# EAGLE design czbd-v0.12 (EAGLE 6.6.0)
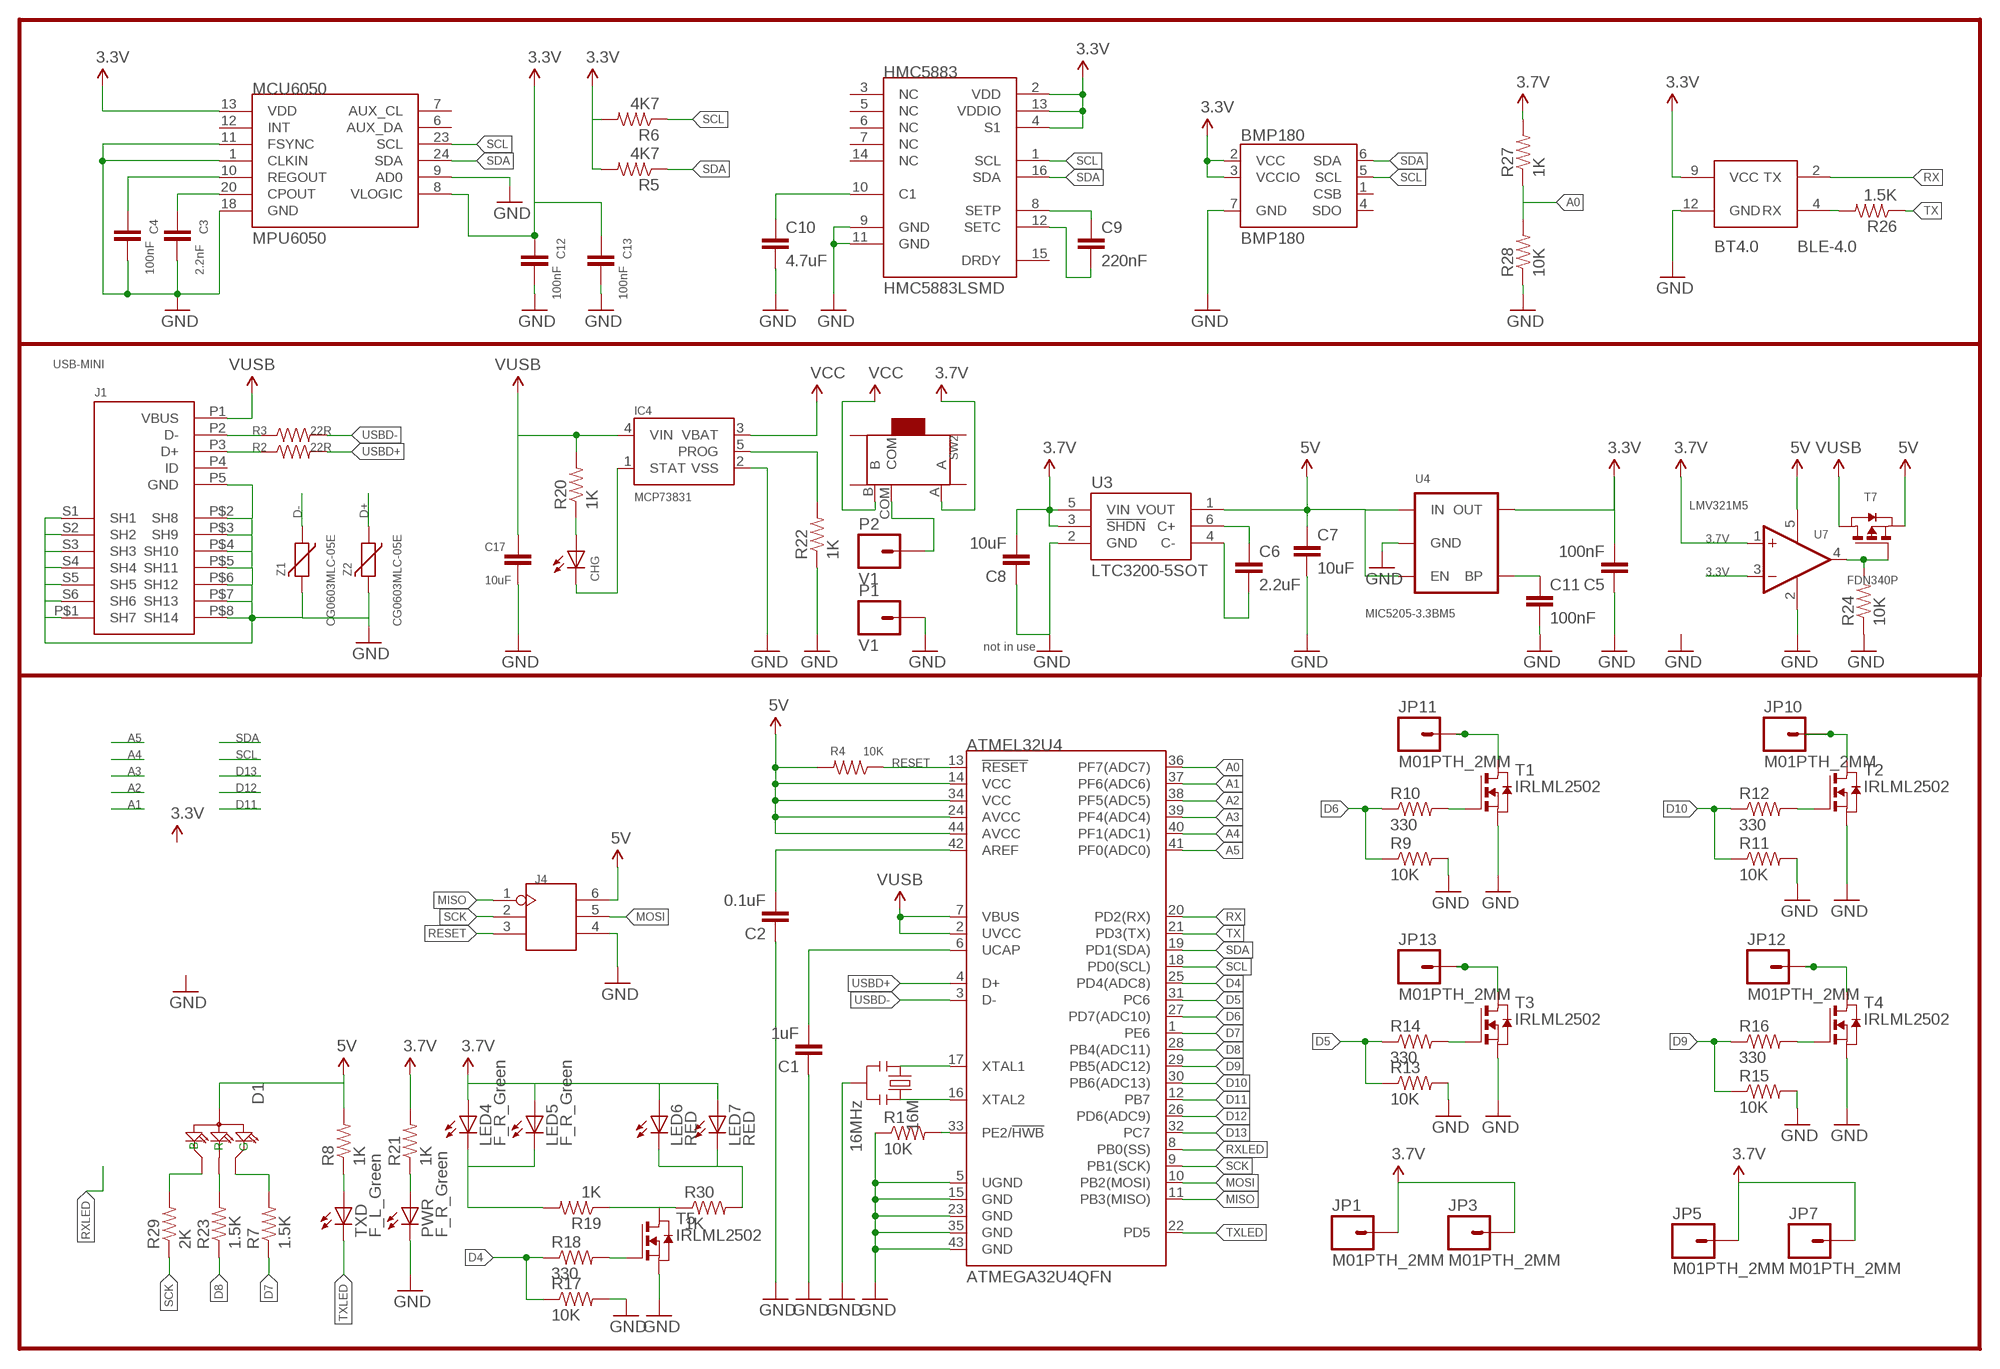
[diagram p0: schematic, sheet 1]

## Parts
16M  16MHz  RESONATOR16MHZ  [RESONATOR-SMD]
ATMEL32U4  ATMEGA32U4QFN  [SPARKFUN-DIGITALIC_QFN-44]
BMP180  BMP180  [BMP180]
BT4.0  BLE-4.0  HEXAIRBOT-HEXNANO_BLUETOOTH_HM11  [HEXAIRBOT-HEXNANO_BLUETOOTH_HM11]
C1  1uF  CAP0402-CAP  [0402-CAP]
C2  0.1uF  CAP0402-CAP  [0402-CAP]
C3  2.2nF  CAP0402-CAP  [0402-CAP]
C4  100nF  CAP0402-CAP  [0402-CAP]
C5  100nF  CAP0402-CAP  [0402-CAP]
C6  2.2uF  CAP0402-CAP  [0402-CAP]
C7  10uF  CAP0402-CAP  [0402-CAP]
C8  10uF  CAP0805  [0805]
C9  220nF  CAP0402-CAP  [0402-CAP]
C10  4.7uF  CAP0402-CAP  [0402-CAP]
C11  100nF  CAP0402-CAP  [0402-CAP]
C12  100nF  CAP0402-CAP  [0402-CAP]
C13  100nF  CAP0402-CAP  [0402-CAP]
C17  10uF  CAP0805  [0805]
CHG  Yellow  LEDCHIPLED_0603  [CHIPLED_0603]
D1  LED-ARGB-4P-1206  [LED-4P-1206-3.0X1.5]
HMC5883  HMC5883LSMD  [16LPCC]
IC4  MCP73831  [SOT23-5]
J1  USB-MINI  [USB_MICRO]
J4  CONNECTOR_HEADER-2X3P-2.0  [CONNECTOR_2X3P-2.0]
JP1  M01PTH_2MM  [1X01_2MM]
JP3  M01PTH_2MM  [1X01_2MM]
JP5  M01PTH_2MM  [1X01_2MM]
JP7  M01PTH_2MM  [1X01_2MM]
JP10  M01PTH_2MM  [1X01_2MM]
JP11  M01PTH_2MM  [1X01_2MM]
JP12  M01PTH_2MM  [1X01_2MM]
JP13  M01PTH_2MM  [1X01_2MM]
LED4  F_R_Green  LEDCHIPLED_0603  [CHIPLED_0603]
LED5  F_R_Green  LEDCHIPLED_0603  [CHIPLED_0603]
LED6  RED  LEDCHIPLED_0603  [CHIPLED_0603]
LED7  RED  LEDCHIPLED_0603  [CHIPLED_0603]
MCU6050  MPU6050  TESTING_MPU-6050-1  [TESTING_QFN-24-4MM2]
P1  V1  M01PTH  [1X01]
P2  V1  M01PTH  [1X01]
PWR  F_R_Green  LEDCHIPLED_0603  [CHIPLED_0603]
R1  10K  RESISTOR0402-RES  [0402-RES]
R2  22R  RESISTOR0402-RES  [0402-RES]
R3  22R  RESISTOR0402-RES  [0402-RES]
R4  10K  RESISTOR0402-RES  [0402-RES]
R5  4K7  RESISTOR0402-RES  [0402-RES]
R6  4K7  RESISTOR0402-RES  [0402-RES]
R7  1.5K  RESISTOR0402-RES  [0402-RES]
R8  1K  RESISTOR0402-RES  [0402-RES]
R9  10K  RESISTOR0402-RES  [0402-RES]
R10  330  RESISTOR0402-RES  [0402-RES]
R11  10K  RESISTOR0402-RES  [0402-RES]
R12  330  RESISTOR0402-RES  [0402-RES]
R13  10K  RESISTOR0402-RES  [0402-RES]
R14  330  RESISTOR0402-RES  [0402-RES]
R15  10K  RESISTOR0402-RES  [0402-RES]
R16  330  RESISTOR0402-RES  [0402-RES]
R17  10K  RESISTOR0402-RES  [0402-RES]
R18  330  RESISTOR0402-RES  [0402-RES]
R19  1K  RESISTOR0402-RES  [0402-RES]
R20  1K  RESISTOR0402-RES  [0402-RES]
R21  1K  RESISTOR0402-RES  [0402-RES]
R22  1K  RESISTOR0402-RES  [0402-RES]
R23  1.5K  RESISTOR0402-RES  [0402-RES]
R24  10K  RESISTOR0402-RES  [0402-RES]
R26  1.5K  RESISTOR0402-RES  [0402-RES]
R27  1K  RESISTOR0402-RES  [0402-RES]
R28  10K  RESISTOR0402-RES  [0402-RES]
R29  2K  RESISTOR0402-RES  [0402-RES]
R30  1K  RESISTOR0402-RES  [0402-RES]
SW2  SWITCH-3P-SMD-6.6X2.8  [3P-SMD-2CH-6.6X2.8-REINFORCE]
T1  IRLML2502  NMOSSOT23  [SOT-23]
T2  IRLML2502  NMOSSOT23  [SOT-23]
T3  IRLML2502  NMOSSOT23  [SOT-23]
T4  IRLML2502  NMOSSOT23  [SOT-23]
T5  IRLML2502  NMOSSOT23  [SOT-23]
T7  FDN340P  [SOT23]
TXD  F_L_Green  LEDCHIPLED_0603  [CHIPLED_0603]
U3  LTC3200-5SOT  [SOT23-6]
U4  MIC5205-3.3BM5  MIC52053.3V  [SOT23-5]
U7  LMV321M5  [SOT23-5]
Z1  CG0603MLC-05E  VARISTORCN0603  [CT/CN0603]
Z2  CG0603MLC-05E  VARISTORCN0603  [CT/CN0603]

## Nets
3.3V: BMP180.2(VCC) BMP180.3(VCCIO) BT4.0.9(VCC) C5.2 C12.1 C13.1 HMC5883.2(VDD) HMC5883.4(S1) HMC5883.13(VDDIO) MCU6050.8(VLOGIC) MCU6050.13(VDD) R5.2 R6.2 U4.5(OUT) U7.3(-IN)
3.7V: C8.2 JP1.1 JP3.1 JP5.1 JP7.1 LED4.A LED5.A LED6.A LED7.A R21.2 R27.2 SW2.A U3.3(!SHDN) U3.5(VIN) U7.1(+IN)
5V: ATMEL32U4.14(VCC) ATMEL32U4.24(AVCC) ATMEL32U4.34(VCC) ATMEL32U4.44(AVCC) C7.1 D1.2(+) J4.6 R4.2 R8.2 T7.2(S) U3.1(VOUT) U4.1(IN) U4.3(EN) U7.5(V+)
A0: ATMEL32U4.36(PF7(ADC7)) R27.1 R28.2
A1: ATMEL32U4.37(PF6(ADC6))
A2: ATMEL32U4.38(PF5(ADC5))
A3: ATMEL32U4.39(PF4(ADC4))
A4: ATMEL32U4.40(PF1(ADC1))
A5: ATMEL32U4.41(PF0(ADC0))
D4: ATMEL32U4.25(PD4(ADC8)) R17.1 R18.1
D5: ATMEL32U4.31(PC6) R13.1 R14.1
D6: ATMEL32U4.27(PD7(ADC10)) R9.1 R10.1
D7: ATMEL32U4.1(PE6) R7.1
D8: ATMEL32U4.28(PB4(ADC11)) R23.1
D9: ATMEL32U4.29(PB5(ADC12)) R15.1 R16.1
D10: ATMEL32U4.30(PB6(ADC13)) R11.1 R12.1
D11: ATMEL32U4.12(PB7)
D12: ATMEL32U4.26(PD6(ADC9))
D13: ATMEL32U4.32(PC7)
D+: J1.P3(D+) R2.1 Z2.1
D-: J1.P2(D-) R3.1 Z1.1
GND [gnd]: 16M.2 ATMEL32U4.5(UGND) ATMEL32U4.15(GND) ATMEL32U4.23(GND) ATMEL32U4.35(GND) ATMEL32U4.43(GND) BMP180.7(GND) BT4.0.12(GND) C1.1 C2.1 C3.2 C4.2 C5.1 C7.2 C8.1 C10.2 C11.2 C12.2 C13.2 C17.1 HMC5883.9(GND) HMC5883.11(GND) IC4.2(VSS) J1.P5(GND) J1.P$1(SH7) J1.P$2(SH8) J1.P$3(SH9) J1.P$4(SH10) J1.P$5(SH11) J1.P$6(SH12) J1.P$7(SH13) J1.P$8(SH14) J1.S1(SH1) J1.S2(SH2) J1.S3(SH3) J1.S4(SH4) J1.S5(SH5) J1.S6(SH6) J4.4 MCU6050.1(CLKIN) MCU6050.9(AD0) MCU6050.11(FSYNC) MCU6050.18(GND) P1.1 PWR.C R1.1 R9.2 R11.2 R13.2 R15.2 R17.2 R22.1 R24.1 R28.1 T1.2(S) T2.2(S) T3.2(S) T4.2(S) T5.2(S) U3.2(GND) U4.2(GND) U7.2(V-) Z1.2 Z2.2
MISO: ATMEL32U4.11(PB3(MISO)) J4.1
MOSI: ATMEL32U4.10(PB2(MOSI)) J4.5
N$1: 16M.1 ATMEL32U4.17(XTAL1)
N$2: 16M.3 ATMEL32U4.16(XTAL2)
N$3: CHG.C IC4.1(STAT)
N$4: CHG.A R20.1
N$5: ATMEL32U4.6(UCAP) C1.2
N$6: ATMEL32U4.42(AREF) C2.2
N$7: R8.1 TXD.A
N$8: C4.1 MCU6050.10(REGOUT)
N$9: C3.1 MCU6050.20(CPOUT)
N$10: D1.1(B) R29.2
N$11: ATMEL32U4.33(PE2/!HWB) R1.2
N$12: R18.2 T5.3(G)
N$13: PWR.A R21.1
N$14: R12.2 T2.3(G)
N$15: R10.2 T1.3(G)
N$16: JP11.1 T1.1(D)
N$17: JP10.1 T2.1(D)
N$18: R14.2 T3.3(G)
N$19: JP13.1 T3.1(D)
N$20: R16.2 T4.3(G)
N$21: JP12.1 T4.1(D)
N$22: R19.1 R30.1 T5.1(D)
N$23: C9.1 HMC5883.8(SETP)
N$24: LED4.C LED5.C R19.2
N$25: C6.1 U3.6(C+)
N$26: IC4.5(PROG) R22.2
N$27: C6.2 U3.4(C-)
N$28: C9.2 HMC5883.12(SETC)
N$29: C10.1 HMC5883.10(C1)
N$30: P2.1 SW2.COM
N$31: C11.1 U4.4(BP)
N$32: D1.4(R) R23.2
N$33: D1.3(G) R7.2
N$34: R24.2 T7.3(G) U7.4(OUT)
N$35: BT4.0.4(RX) R26.2
N$36: LED6.C LED7.C R30.2
RESET: ATMEL32U4.13(!RESET) J4.3 R4.1
RX: ATMEL32U4.20(PD2(RX)) BT4.0.2(TX)
RXLED: ATMEL32U4.8(PB0(SS))
SCK: ATMEL32U4.9(PB1(SCK)) J4.2 R29.1
SCL: ATMEL32U4.18(PD0(SCL)) BMP180.5(SCL) HMC5883.1(SCL) MCU6050.23(SCL) R6.1
SDA: ATMEL32U4.19(PD1(SDA)) BMP180.6(SDA) HMC5883.16(SDA) MCU6050.24(SDA) R5.1
TX: ATMEL32U4.21(PD3(TX)) R26.1
TXLED: ATMEL32U4.22(PD5) TXD.C
USBD+: ATMEL32U4.4(D+) R2.2
USBD-: ATMEL32U4.3(D-) R3.2
VCC: IC4.3(VBAT) SW2.B
VUSB: ATMEL32U4.2(UVCC) ATMEL32U4.7(VBUS) C17.2 IC4.4(VIN) J1.P1(VBUS) R20.2 T7.1(D)
Unconnected: BMP180.1(CSB) BMP180.4(SDO) HMC5883.3(NC) HMC5883.5(NC) HMC5883.6(NC) HMC5883.7(NC) HMC5883.14(NC) HMC5883.15(DRDY) J1.P4(ID) MCU6050.6(AUX_DA) MCU6050.7(AUX_CL) MCU6050.12(INT) SW2.SS1 SW2.SS2 SW2.SS3 SW2.SS4

## Notes on the sheet
- not in use

## Library data of the parts
16M = SparkFun-FreqCtrl:RESONATOR: Resonator Small SMD resonator. Used, eg, on the Arduino Pro/ Pro Mini boards. 8MHz- XTAL-08895 16MHz- XTAL-08900; PROD_ID: XTAL-08900
ATMEL32U4 = SparkFun-DigitalIC:ATMEGA32U4: Atmel 44-pin 8-bit Microcontroller with 32KBytes of ISP Flash and USB Controller ----- Please use the QFN-44-NOPAD_1:1 package for the footprint of all boards using a 32U4. Route traces directly away from the pads as much as possible.
BMP180 = duinofun-ic:BMP180: BMP085 Pressure Sensor Great little MEMS pressure sensor. SKU: COM-09603
BT4.0 = MainBoard:HEXAIRBOT-HEXNANO_BLUETOOTH_HM11: BLE 4.0 Module
C1-C13 = SparkFun-Passives:CAP: Capacitor Standard 0603 ceramic capacitor, and 0.1" leaded capacitor.
C17 = SparkFun:CAP: Capacitor Standard 0603 ceramic capacitor, and 0.1" leaded capacitor.
CHG LED4-LED7 PWR TXD = led:LED: LED OSRAM: - CHIPLED LG R971, LG N971, LY N971, LG Q971, LY Q971, LO R971, LY R971 LH N974, LH R974 LS Q976, LO Q976, LY Q976 LO Q996 - Hyper CHIPLED LW Q18S LB Q993, LB Q99A, LB R99A - SideLED LS A670, LO A670, LY A670, LG A670, LP A670 LB A673, LV A673, LT A673, LW A673 LH A674 LY A675 LS A676, LA A676, LO A676, LY A676, LW A676 LS A679, LY A679, LG A679 - Hyper Micro SIDELED® LS Y876, LA Y876, LO Y876, LY Y876 LT Y87S - SmartLED LW L88C, LW L88S LB L89C, LB L89S, LG L890 LS L89K, LO L89K, LY L89K LS L896, LA L896, LO L896, LY L896 - TOPLED LS T670, LO T670, LY T670, LG T670, LP T670 LSG T670, LSP T670, LSY T670, LOP T670, LYG T670 LG T671, LOG T671, LSG T671 LB T673, LV T673, LT T673, LW T673 LH T674 LS T676, LA T676, LO T676, LY T676, LB T676, LH T676, LSB T676, LW T676 LB T67C, LV T67C, LT T67C, LS T67K, LO T67K, LY T67K, LW E67C LS E67B, LA E67B, LO E67B, LY E67B, LB E67C, LV E67C, LT E67C LW T67C LS T679, LY T679, LG T679 LS T770, LO T770, LY T770, LG T770, LP T770 LB T773, LV T773, LT T773, LW T773 LH T774 LS E675, LA E675, LY E675, LS T675 LS T776, LA T776, LO T776, LY T776, LB T776 LHGB T686 LT T68C, LB T68C - Hyper Mini TOPLED® LB M676 - Mini TOPLED Santana® LG M470 LS M47K, LO M47K, LY M47K Source: http://www.osram.convergy.de LUXEON: - LUMILED® LXK2-PW12-R00, LXK2-PW12-S00, LXK2-PW14-U00, LXK2-PW14-V00 LXK2-PM12-R00, LXK2-PM12-S00, LXK2-PM14-U00 LXK2-PE12-Q00, LXK2-PE12-R00, LXK2-PE12-S00, LXK2-PE14-T00, LXK2-PE14-U00 LXK2-PB12-K00, LXK2-PB12-L00, LXK2-PB12-M00, LXK2-PB14-N00, LXK2-PB14-P00, LXK2-PB14-Q00 LXK2-PR12-L00, LXK2-PR12-M00, LXK2-PR14-Q00, LXK2-PR14-R00 LXK2-PD12-Q00, LXK2-PD12-R00, LXK2-PD12-S00 LXK2-PH12-R00, LXK2-PH12-S00 LXK2-PL12-P00, LXK2-PL12-Q00, LXK2-PL12-R00 Source: www.luxeon.com KINGBRIGHT: KA-3528ASYC Source: www.kingbright.com
D1 = duinofun-main:LED-ARGB*-4P
HMC5883 = HexAirbot-HexNano:HMC5883L: 3 Axis Digital Compass IC
IC4 = SparkFun:MCP73831: Microchip's MCP73831 Miniature single cell, fully integrated Li-Ion, Li-polymer charge management controller http://ww1.microchip.com/downloads/en/DeviceDoc/21984a.pdf
J1 = QXZ:USB-MINI
J4 = duinofun-connector:CONNECTOR_HEADER-2X3P
JP1 JP3 JP5 JP7 JP10-JP13 = duinofun-connector:M01: Header 1 Standard 1-pin 0.1" header. Use with straight break away headers (SKU : PRT-00116), right angle break away headers (PRT-00553), swiss pins (PRT-00743), machine pins (PRT-00117), and female headers (PRT-00115).
MCU6050 = MPU6050:TESTING_MPU-6050
P1 P2 = SparkFun-Connectors:M01: Header 1 Standard 1-pin 0.1" header. Use with straight break away headers (SKU : PRT-00116), right angle break away headers (PRT-00553), swiss pins (PRT-00743), machine pins (PRT-00117), and female headers (PRT-00115).
R1-R24 R26-R30 = SparkFun-Passives:RESISTOR: Resistor Basic schematic elements and footprints for 0603, 1206, and PTH resistors.
SW2 = duinofun-ic:SWITCH-3P-SMD
T1-T5 = zetex:NMOSSOT23: MOS FET; OC_FARNELL: unknown; OC_NEWARK: unknown
T7 = HexAirbot-HexNano:FDN340P: MOS FET
U3 = HexAirbot-HexNano:LTC3200-5: Linear Technology. Low Noise, Regulated Charge Pump DC/DC Converters, SOT23-6. Fixed 5V ± 4% Output or ADJ VIN Range: 2.7V to 4.5V
U4 = SparkFun-PowerIC:MIC5205: MIC5205 150mA vreg 3.3V - VREG-00822 5V - VREG-00823; PROD_ID: VREG-00822
U7 = linear:LMV321?*: General Purpose, Low Voltage, Rail-to-Rail Output Operational Amplifiers Source: http://www.national.com/mpf/LM/LMV321.html http://www.national.com/dt/lmv_qual.pdf
Z1 Z2 = varistor:VARISTOR: VARISTOR

## Net classes
0 default: width 0.254 mm, drill 0.61 mm, clearance 0.254 mm
2 gnd: width 0.254 mm, drill 0.61 mm, clearance 0.254 mm

## Board
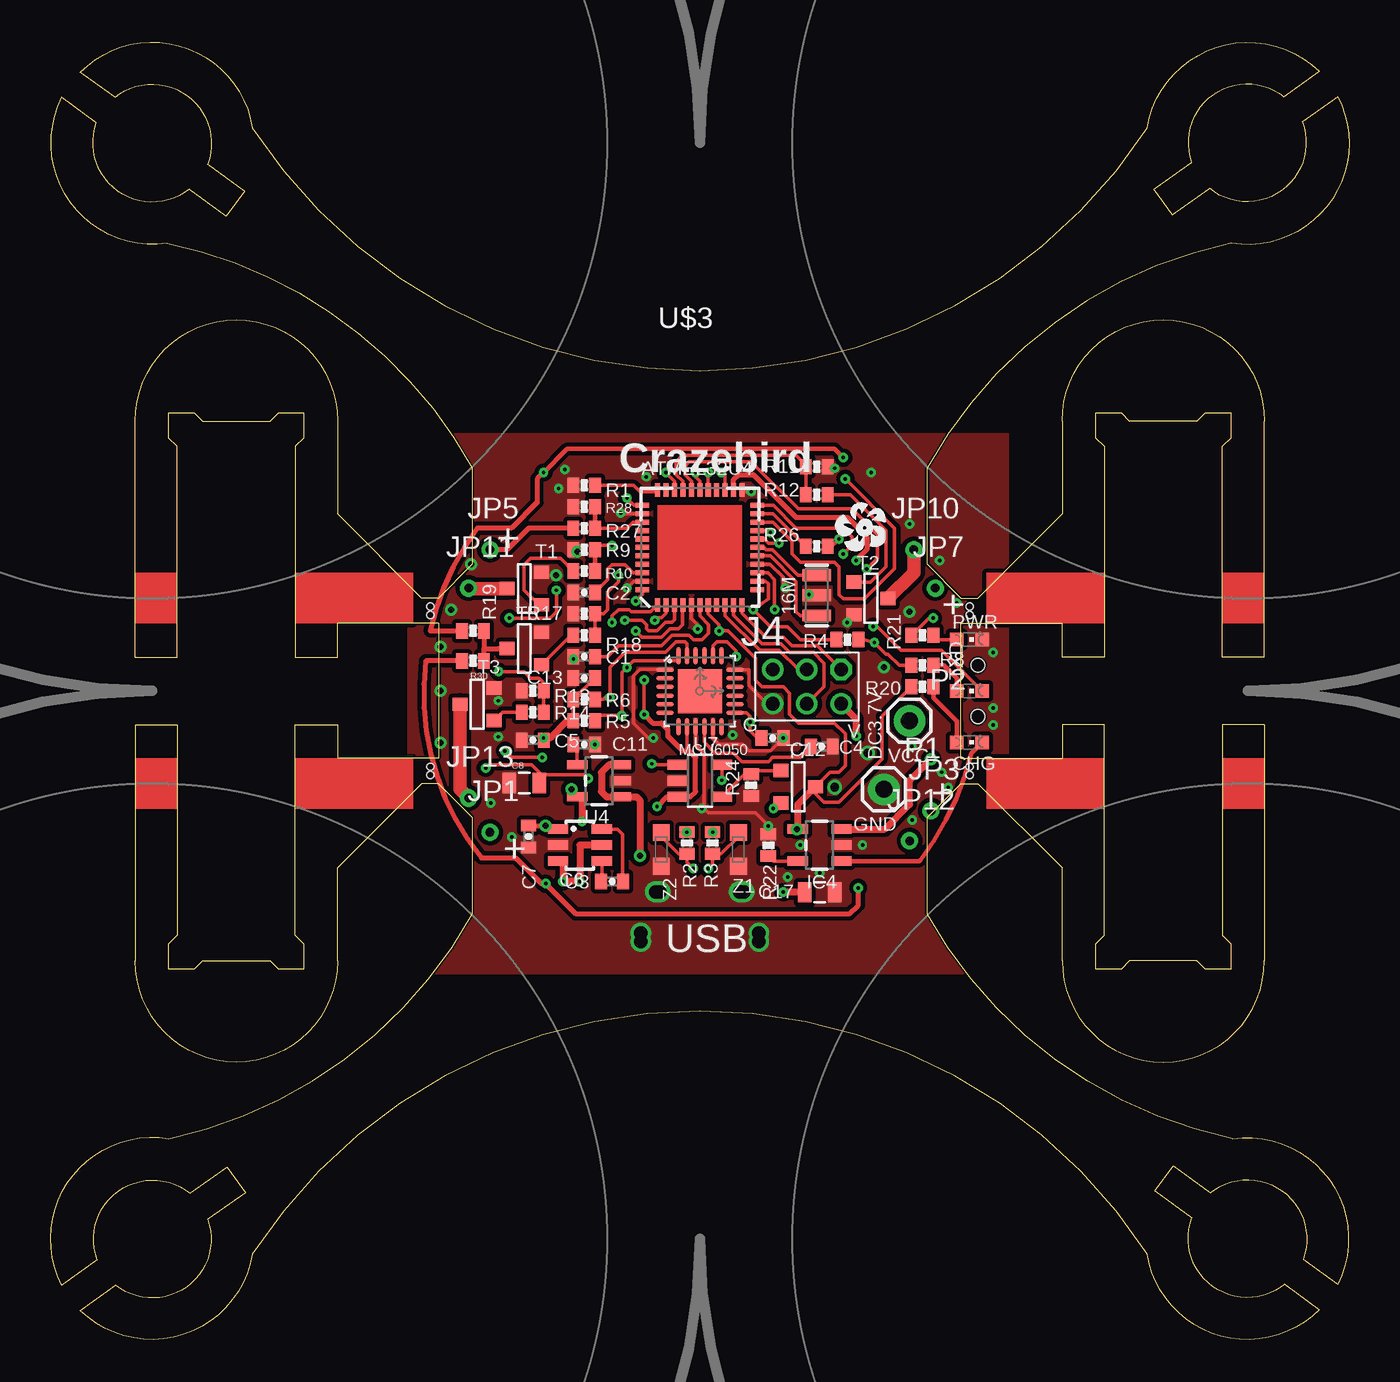
[diagram p1: board, top side]
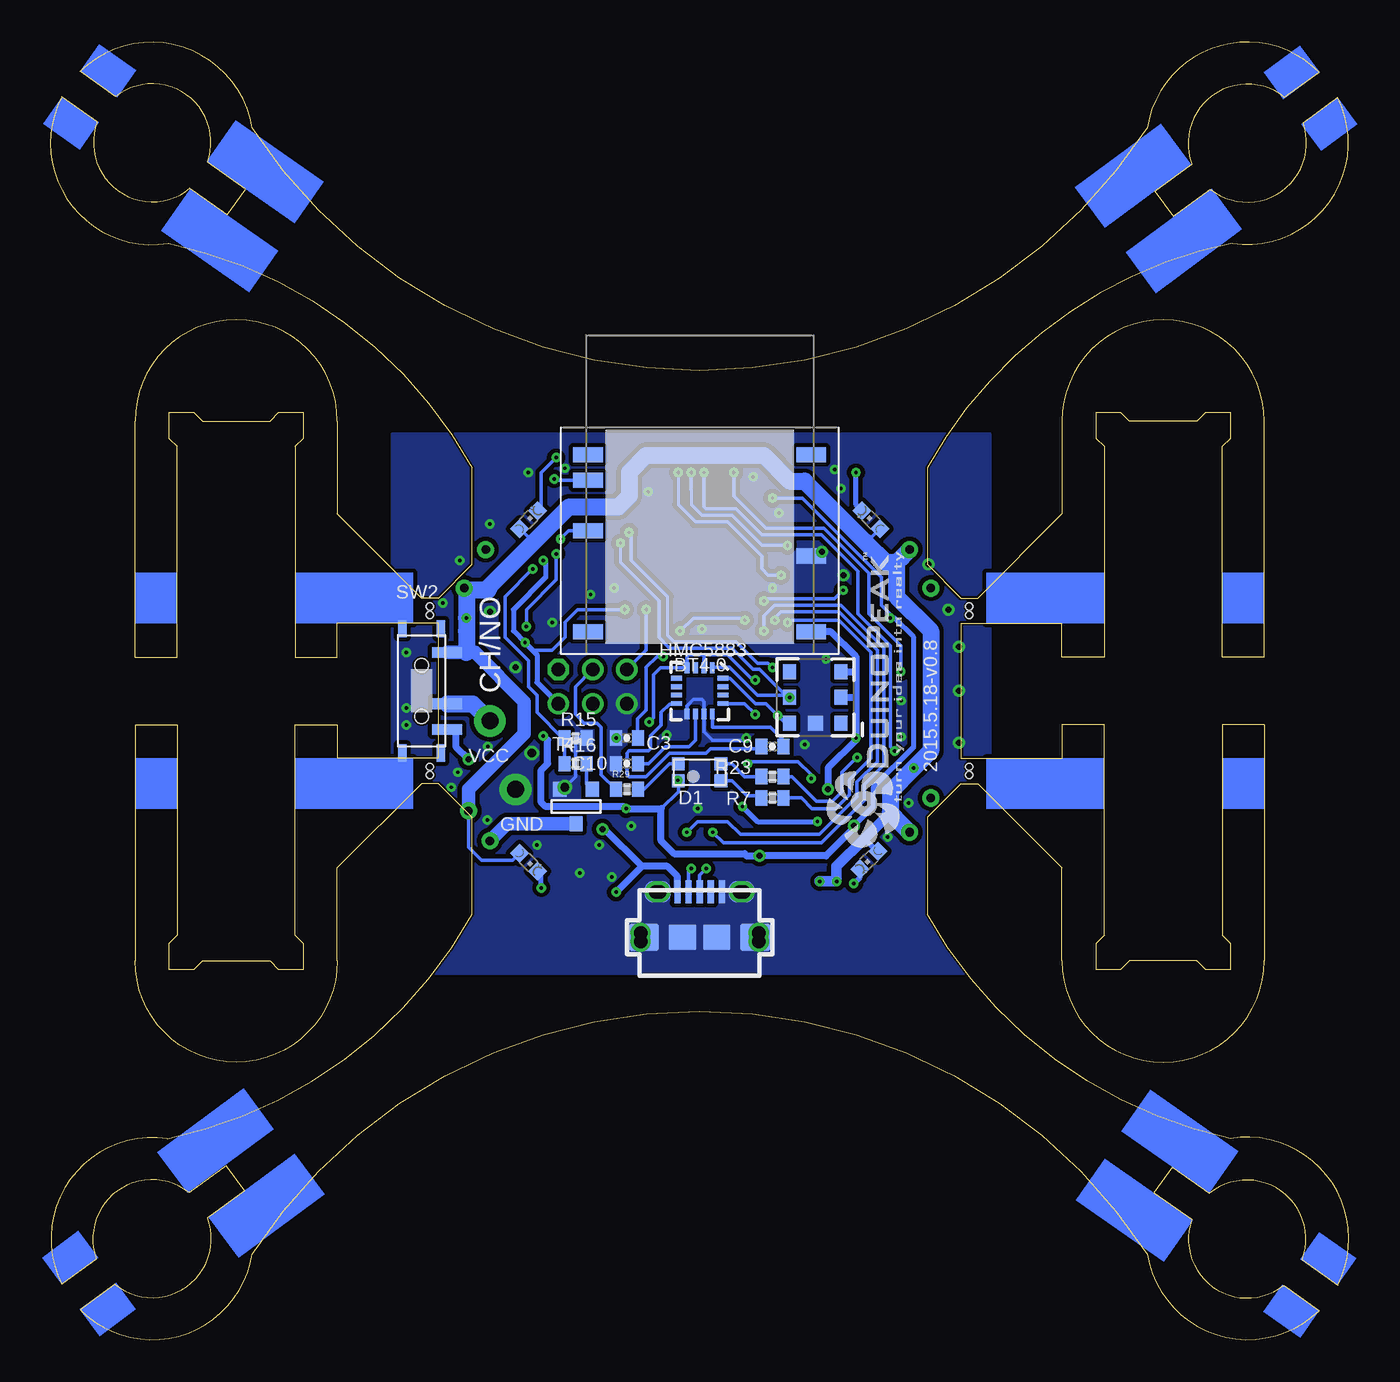
[diagram p2: board, bottom side, seen from below]

Size 77.04 x 76.96 mm. Coordinates in mm from the lower left corner, seen from the top.
Copper layers (1*16): Top 0.035mm / dielectric 1.5mm / Bottom 0.035mm
Design rules "Sparkfun *": minimum track width 10mil, minimum drill 10mil, track to track 5mil, track to pad 5mil, pad to pad 8mil, via to via 8mil, smd to smd 8mil, copper to edge 5mil, drill to drill 5mil, minimum pad ring 7mil, minimum via ring 7mil, stop-mask expansion 1mil, vias tented up to drill 25mil, thermal gap 2mil

### Footprints (pad centres in the part's own frame; a part is rotated, then mirrored left to right if it is on the bottom)
RESONATOR-SMD = smd 0.7 x 1.7: 1 -1.2,0; 2 0,0; 3 1.2,0
SPARKFUN-DIGITALIC_QFN-44 = smd 0.8 x 0.3: 1 -3.4,2.5; 2 -3.4,2; 3 -3.4,1.5; 4 -3.4,1; 5 -3.4,0.5; 6 -3.4,0; 7 -3.4,-0.5; 8 -3.4,-1; 9 -3.4,-1.5; 10 -3.4,-2; 11 -3.4,-2.5; 23 3.4,-2.5; 24 3.4,-2; 25 3.4,-1.5; 26 3.4,-1; 27 3.4,-0.5; 28 3.4,0; 29 3.4,0.5; 30 3.4,1; 31 3.4,1.5; 32 3.4,2; 33 3.4,2.5 | smd 0.3 x 0.8: 12 -2.5,-3.4; 13 -2,-3.4; 14 -1.5,-3.4; 15 -1,-3.4; 16 -0.5,-3.4; 17 0,-3.4; 18 0.5,-3.4; 19 1,-3.4; 20 1.5,-3.4; 21 2,-3.4; 22 2.5,-3.4; 34 2.5,3.4; 35 2,3.4; 36 1.5,3.4; 37 1,3.4; 38 0.5,3.4; 39 0,3.4; 40 -0.5,3.4; 41 -1,3.4; 42 -1.5,3.4; 43 -2,3.4; 44 -2.5,3.4
BMP180 = smd 0.762 x 0.889: 1 0,0; 2 0,-1.524; 3 0,-3.048; 4 3.048,-3.048; 5 3.048,-1.524; 6 3.048,0 | smd 0.889 x 0.889: 7 1.524,0
HEXAIRBOT-HEXNANO_BLUETOOTH_HM11 = smd 1.75 x 0.9: 1 -6.625,4.859; 2 -6.625,3.359; 4 -6.625,0.359; 8 -6.625,-5.641; 9 6.625,-5.641; 12 6.625,-1.141; 16 6.625,4.859
0402-CAP = smd 0.7 x 0.9: 1 -0.65,0; 2 0.65,0
0805 = smd 0.8 x 1.2: 1 -0.9,0; 2 0.9,0
CHIPLED_0603 = smd 0.8 x 0.8: A 0,-0.75; C 0,0.75
LED-4P-1206-3.0X1.5 = smd 0.762 x 0.762: 1 -1.27,0.508; 2 -1.27,-0.508; 3 1.27,-0.508; 4 1.27,0.508
16LPCC = smd 0.65 x 0.28: 1 -1.37,0.75; 2 -1.37,0.25; 3 -1.37,-0.25; 4 -1.37,-0.75; 9 1.37,-0.75; 10 1.37,-0.25; 11 1.37,0.25; 12 1.37,0.75 | smd 0.28 x 0.65: 5 -0.75,-1.37; 6 -0.25,-1.37; 7 0.25,-1.37; 8 0.75,-1.37; 13 0.75,1.37; 14 0.25,1.37; 15 -0.25,1.37; 16 -0.75,1.37
SOT23-5 = smd 0.55 x 1.2: 1 -0.95,-1.3; 2 0,-1.3; 3 0.95,-1.3; 4 0.95,1.3; 5 -0.95,1.3
USB_MICRO = smd 0.406 x 1.346: P1 -1.321,2.692; P2 -0.66,2.692; P3 0,2.692; P4 0.66,2.692; P5 1.321,2.692 | drill 0.8 pad 1.27: P$1 -2.616,2.692 | drill 0.8 pad 1.245: P$2 -2.362,2.692; P$7 2.362,2.692; P$8 2.616,2.692 | drill 0.8 pad 1.143: P$3 -3.505,-0.254; P$4 -3.505,0.254; P$5 3.505,0.254; P$6 3.505,-0.254 | smd 1.778 x 1.651: S1 -3.302,0; S2 3.302,0 | smd 1.524 x 1.27: S3 -2.489,2.692; S4 2.489,2.692 | smd 1.626 x 1.524: S5 -1.016,0; S6 1.016,0
CONNECTOR_2X3P-2.0 = drill 0.813 pad 1.27 octagon: 1 -1.016,2.032 | drill 0.813 pad 1.27: 2 -1.016,0; 3 -1.016,-2.032; 4 1.016,-2.032; 5 1.016,0; 6 1.016,2.032
1X01_2MM = drill 0.508 pad 1.016: 1 0,0
TESTING_QFN-24-4MM2 = smd 1.016 x 0.254: 1 -2.066,1.257; 2 -2.066,0.75; 3 -2.066,0.247; 4 -2.066,-0.287; 5 -2.066,-0.792; 6 -2.066,-1.297; 13 2.086,-1.297; 14 2.086,-0.792; 15 2.086,-0.287; 16 2.086,0.247; 17 2.086,0.75; 18 2.086,1.257 | smd 0.254 x 1.016: 7 -1.267,-2.122; 8 -0.762,-2.122; 9 -0.258,-2.122; 10 0.278,-2.122; 11 0.78,-2.122; 12 1.287,-2.122; 19 1.287,2.082; 20 0.78,2.082; 21 0.278,2.082; 22 -0.258,2.082; 23 -0.762,2.082; 24 -1.267,2.082 | smd 2.616 x 2.616: P$1 0.02,-0.01
1X01 = drill 1.016 pad 1.88: 1 0,0
0402-RES = smd 0.7 x 0.9: 1 -0.65,0; 2 0.65,0
3P-SMD-2CH-6.6X2.8-REINFORCE = smd 1.778 x 0.635: A 1.524,2.286; B 1.524,-2.286; COM 1.524,-0.762 | smd 0.508 x 1.016: SS1 -1.143,-3.683; SS2 1.143,-3.683; SS3 1.143,3.683; SS4 -1.143,3.683 | hole 0.813: 0,-1.524; 0,1.524
SOT-23 = smd 0.787 x 0.889: 1 0.025,-1.016; 2 -0.94,1.016; 3 0.991,1.016
SOT23 = smd 0.787 x 0.889: 1 0.025,-1.016; 2 -0.94,1.016; 3 0.991,1.016
SOT23-6 = smd 0.55 x 1.2: 1 -0.95,-1.3; 2 0,-1.3; 3 0.95,-1.3; 4 0.95,1.3; 5 0,1.3; 6 -0.95,1.3
SOT23-5' = smd 0.6 x 1.2: 1 -0.95,-1.306; 2 0,-1.306; 3 0.95,-1.306; 4 0.95,1.306; 5 -0.95,1.306
MINI-4-ZOU+48 = hole 0.4: 16,5; 16,4.5; -16,5; -16,4.5; -16,-4.5; -16,-5; 16,-4.5; 16,-5
CT/CN0603 = smd 1 x 1: 1 -1,0; 2 1,0

### Placement (x,y rotation side)
16M  45.45,44.15 270 top
ATMEL32U4  38.51,46.99 90 top
BMP180  30.13,36.57 180 bottom
BT4.0  38.51,47.62 0 bottom
C1  31.66,40.51 0 top
C2  31.66,44.32 0 top
C3  42.83,35.68 180 bottom
C4  45.75,35.18 0 top
C5  28.61,35.56 0 top
C6  33.31,27.18 180 top
C7  28.35,29.84 270 top
C8  28.1,33.02 0 top
C9  34.2,35.18 0 bottom
C10  42.83,34.16 180 bottom
C11  31.66,35.3 0 top
C12  42.83,35.68 0 top
C13  31.66,39.24 180 top
C17  45.63,26.54 180 top
CHG  54.52,35.43 270 top
D1  38.51,33.65 0 bottom
HMC5883  38.51,38.48 270 bottom
IC4  45.63,29.33 90 top
J1  38.51,23.87 0 bottom
J4  44.86,38.73 270 top
JP1  26.07,30.1 0 top
JP3  52.23,31.37 0 top
JP5  26.07,46.86 0 top
JP7  52.48,44.57 0 top
JP10  51.21,46.86 0 top
JP11  24.8,44.57 0 top
JP12  50.96,29.59 0 top
JP13  24.8,32.13 0 top
LED4  28.35,48.64 45 bottom
LED5  48.67,48.64 315 bottom
LED6  48.67,28.32 225 bottom
LED7  28.48,28.45 135 bottom
MCU6050  38.51,38.48 0 top
P1  49.44,32.64 0 top
P2  50.96,36.7 0 top
PWR  54.52,41.53 270 top
R1  31.66,50.67 0 top
R2  37.75,29.46 90 top
R3  39.28,29.46 90 top
R4  47.28,41.53 0 top
R5  31.66,36.7 180 top
R6  31.66,37.97 180 top
R7  34.2,32.13 180 bottom
R8  51.72,40 180 top
R9  31.66,46.86 180 top
R10  31.66,45.59 180 top
R11  45.45,51.77 0 top
R12  45.45,50.11 0 top
R13  28.61,38.48 180 top
R14  28.61,37.21 180 top
R15  45.88,35.68 0 bottom
R16  45.88,34.16 0 bottom
R17  31.66,43.05 180 top
R18  31.66,41.78 180 top
R19  25.05,42.03 180 top
R20  51.72,38.73 180 top
R21  51.72,41.78 180 top
R22  42.58,29.33 270 top
R23  34.2,33.4 180 bottom
R24  41.56,32.89 90 top
R26  45.45,47.07 0 top
R27  31.66,48.13 180 top
R28  31.66,49.4 0 top
R29  42.83,32.64 0 bottom
R30  25.05,40.26 180 top
SW2  55.01,38.48 0 bottom
T1  28.1,44.57 270 top
T2  48.67,43.94 90 top
T3  25.31,37.72 270 top
T4  45.88,31.62 0 bottom
T5  28.1,41.02 270 top
T7  44.36,32.76 90 top
TXD  54.51,38.48 270 top
U3  31.4,29.33 270 top
U4  32.55,33.14 90 top
U7  LMV321M5  [SOT23-5']  38.51,33.14 270 top
U$2  [DUINOFUN-LOGO-PCB-0.4]  46.52,46.73 0 top
U$3  [MINI-4-ZOU+48]  38.51,38.48 0 top
U$4  [DUINOPEAK-LOGO-0.6]  26.39,29.14 90 bottom
Z1  40.8,29.08 270 top
Z2  36.23,29.08 270 top

### Tracks (layer width: path | path; a pad name or v marks a point on that pad's centre or on a via)
3.3V  (via drill 0.2, 0.36)  (1 unrouted)
  Top 0.203: C13.1 32.28,39.24 R6.2 R5.2 | MCU6050.8 37.75,35.68 | MCU6050.8 | MCU6050.8 37.75,34.92 | v35.21,37.08 v35.21,39.11 | 36.55,32.19 U7.3 | C12.1 41.94,35.68 41.5,36.13 v41.5,36.64 41.5,36.96 41.28,37.18 MCU6050.13
  Top 0.305: 36.55,32.19 v35.97,31.62 | U7.3 37.95,32.19 38.26,32.51 38.26,34.54 37.88,34.92 37.75,34.92 37.5,34.92 36.61,35.81 36.61,36.19 36.23,36.57 35.72,36.57 v35.21,37.08
  Top 0.406: 31.02,36.69 R5.2 30.64,36.7 29.62,35.68 v29.24,35.68 | v30.89,32.64 30.89,32.19 U4.5 31.53,32.19 v31.53,30.73
  Bottom 0.203: 38.26,40.63 38.26,40.64 | HMC5883.2 38.26,40.64 | 38.26,40.64 36.86,40.64 35.34,39.11 v35.21,39.11 | HMC5883.13 37.13,37.72 35.85,37.72 v35.21,37.08 | 38.26,40.64 39.28,40.64 39.28,39.86 HMC5883.4 40.83,39.85 41.25,39.43 41.25,36.89 v41.5,36.64
  Bottom 0.305: v35.97,31.62 35.09,30.73 v31.53,30.73
  Bottom 0.406: BT4.0.9 30.71,41.98 29.26,40.53 29.26,39.62 | 29.26,39.62 29.26,38.1 | BMP180.3 29.26,39.62 | BMP180.2 29.26,38.1 | 29.26,38.1 29.24,38.08 v29.24,35.68 29.24,35.56 30.89,33.91 v30.89,32.64
3.7V  (via drill 0.2)
  Top 0.203: 26.08,30.1 JP1.1 | 29,33.5 31.68,33.5 v31.91,33.27 | R21.2 51.09,41.78 52.1,42.8 v52.36,42.8 | C8.2 29,33.5 | 29,33.5 29,33.62 28.53,34.08 25.99,34.08 v25.81,33.91 | U7.1 35.72,34.09 v35.66,34.16
  Top 0.305: R27.2 28.35,48.13 27.08,46.86 JP5.1
  Top 0.406: U3.3 30.39,28.38 v30.39,27.18 v31.4,27.18 31.4,29.33 U3.5
  Bottom 0: SW2.A
  Bottom 0.203: 27.28,31.3 27.21,31.24 26.96,30.99 | 27.34,31.37 27.28,31.3 | 27.28,31.3 27.28,31.18 | LED6.A 49.61,28.45 51.47,28.45 52.23,29.21 JP3.1 | v35.66,34.16 35.53,34.29 32.67,34.29 31.91,33.53 v31.91,33.27 | 52.36,42.29 52.36,42.03 | LED5.A 48.59,47.5 48.17,47.5 | LED4.A 28.63,47.3 28.67,47.3
  Bottom 0.254: 26.45,46.73 26.45,46.48
  Bottom 0.305: 26.58,30.1 JP1.1 | LED7.A 27.87,28.85 28.74,29.72
  Bottom 0.61: 26.83,30.86 26.96,30.99 | v31.4,27.18 v30.39,27.18 30.39,28.06 28.74,29.72 27.28,31.18 27.21,31.24
  Bottom 0.813: JP3.1 52.23,32.64 48.93,35.94 48.93,37.84 51.85,40.76 52.36,40.76 SW2.A
  Bottom 1.016: JP5.1 26.45,46.48 26.83,46.1 | 26.83,46.1 27.47,46.1 28.67,47.3 32.29,50.92 33.18,50.92 34.7,52.45 41.69,52.45 42.71,51.43 42.71,50.04 43.34,49.4 46.26,49.4 48.17,47.5 50.95,44.72 51.07,44.45 52.36,44.45 | 26.96,30.99 JP1.1 | 26.83,46.1 26.83,44.07 24.8,42.03 24.8,34.92 v25.81,33.91 27.21,32.51 27.21,31.24 | JP7.1 52.36,44.45 | 52.36,44.45 v52.36,42.8 52.36,42.03 52.36,40.76
5V  (via drill 0.2, 0.36)
  Top 0.203: 39.91,34.16 39.85,34.16 U7.5 v39.82,33.18 | ATMEL32U4.44 35.11,44.22 v34.7,43.81 | ATMEL32U4.14 42.55,45.49 42.96,45.08 v42.96,43.3 | R4.2 48.29,41.53 v48.88,41.35 49.56,40.66 49.69,40.66 50.35,40 R8.2 50.71,40 | v27.21,42.8 29.62,42.8 30.01,43.18 v30.01,44.45 | v34.2,49.91 34.62,49.49 ATMEL32U4.34
  Top 0.305: ATMEL32U4.24 40.51,51.02 40.8,51.31 41.69,51.31 44.23,48.77 47.28,48.77 48.42,47.62 48.42,46.86 v47.79,46.23 | C7.1 28.37,30.48 v29.37,30.48
  Top 0.406: U3.1 29.56,30.28 v29.37,30.48 | T7.2 43.01,31.49 v42.88,31.49 | J4.6 47.79,36.83 v47.79,35.81 | U4.3 33.11,34.09 32.67,33.65 32.67,32.51 32.99,32.19 U4.1 34.77,32.19 34.96,32 v34.96,28.7
  Bottom 0.203: v34.7,43.81 34.58,43.94 30.51,43.94 v30.01,44.45 | v34.2,49.91 32.42,49.91 27.72,45.21 27.72,43.56 26.96,42.8 v27.21,42.8 | v48.88,41.35 48.42,40.89 47.28,40.89 46.52,41.65 46.52,42.54 45.75,43.3 v42.96,43.3 | 40.8,31.49 39.78,32.51 D1.2 v39.82,33.18
  Bottom 0.305: J4.6 48.17,38.99 48.17,40.64 v48.88,41.35 49.56,42.03 49.56,43.3 47.66,45.21 47.66,46.1 v47.79,46.23 | 26.96,42.8 25.81,41.65 25.81,35.18 28.23,32.76 28.23,31.62 v29.37,30.48
  Bottom 0.406: v29.37,30.48 29.37,30.35 31.02,28.7 v34.96,28.7 35.72,28.7 35.85,28.83 40.04,28.83 40.8,29.59 40.8,31.49 v42.88,31.49 43.01,31.62 47.66,31.62 47.91,31.87 47.91,33.78 47.53,34.16 47.53,35.56 v47.79,35.81
A0
  Top 0.203: 32.31,48.49 R27.1 34.2,48.13 34.55,48.49 ATMEL32U4.36
  Top 0.254: R27.1 R28.2
D4  (via drill 0.2)
  Top 0.203: R18.1 R17.1 32.8,43.05 33.05,43.3 33.05,44.32 33.69,44.96 v33.69,45.34 | ATMEL32U4.25 40.01,51.2 v39.78,51.43
  Bottom 0.203: v39.78,51.43 39.78,49.53 38.77,48.51 36.86,48.51 34.83,46.48 34.83,45.72 34.45,45.34 v33.69,45.34
D5  (via drill 0.2)
  Top 0.203: R14.1 R13.1 29.26,38.97 28.99,39.24 28.48,39.24 28.1,39.62 v26.58,39.62 | ATMEL32U4.31 37.01,50.9 v36.48,51.43
  Bottom 0.203: v36.48,51.43 36.48,50.04 34.58,48.13 31.15,48.13 28.48,45.46 28.48,43.05 26.58,41.15 v26.58,39.62
D6  (via drill 0.2)
  Top 0.203: ATMEL32U4.27 v39.01,51.42 v39.02,51.43 | 32.31,46.35 32.31,46.48 32.31,47.11 v33.31,47.11
  Top 0.254: R10.1 32.31,46.1 32.31,46.35 R9.1
  Bottom 0.203: v39.02,51.43 ATMEL32U4.27 39.01,49.52 38.39,48.89 36.61,48.89 34.83,47.11 v33.31,47.11
D7  (via drill 0.2)
  Top 0.203: ATMEL32U4.1 35.59,43.17 34.46,43.17 34.32,43.3 33.69,43.3 33.31,42.92 v33.31,42.54
  Bottom 0.203: v33.31,42.54 33.18,42.67 30.26,42.67 28.35,40.76 28.35,34.48 29.62,33.21 29.62,32.32 30.45,31.49 31.85,31.49 32.48,32.13 R7.1
D8  (via drill 0.2)
  Top 0.203: v38.26,51.43 38.26,51.18 38.51,50.92 ATMEL32U4.28 | v26.96,34.92 27.34,34.54 v29.18,34.54
  Bottom 0.203: v38.26,51.43 38.26,49.4 38.13,49.27 36.36,49.27 34.83,47.75 31.28,47.75 29.12,45.59 29.12,43.05 27.21,41.15 27.21,35.18 v26.96,34.92 | v29.18,34.54 30.07,33.65 30.07,32.51 30.64,31.94 31.59,31.94 33.05,33.4 R23.1
D9  (via drill 0.2)
  Top 0.203: ATMEL32U4.29 38.01,50.92 37.63,51.31 37.63,51.81 37.88,52.07 41.56,52.07 44.36,49.27 47.53,49.27 49.06,47.75 49.06,46.35 v48.42,45.72
  Bottom 0.203: R16.1 R15.1 46.64,35.68 48.17,37.21 48.17,38.22 48.67,38.73 48.67,40.26 50.07,41.65 50.07,44.07 v48.42,45.72
D10
  Top 0.203: R12.1 R11.1 44.8,51.88 44.23,52.45 37.5,52.45 37.12,52.07 37.12,51.31 37.51,50.91 ATMEL32U4.30
D+  (via drill 0.2)
  Top 0.203: Z2.1 36.23,29.84 37.26,28.81 R2.1 37.75,28.32 v38.13,27.94
  Bottom 0.203: J1.P3 38.51,27.56 v38.13,27.94
D-  (via drill 0.2)
  Top 0.203: Z1.1 40.8,29.84 39.77,28.81 R3.1 39.28,28.19 v39.02,27.94
  Bottom 0.203: J1.P2 39.17,27.79 v39.02,27.94
GND  (via drill 0.2, 0.36, 0.51)
  Top 0.203: ATMEL32U4.5 38.01,43.45 38.01,42.8 38.39,42.42 v38.39,42.16 | MCU6050.1 34.96,39.75 34.58,39.37 34.58,36.57 35.47,35.68 v35.75,35.68 | ATMEL32U4.43 34.61,44.99 v34.2,44.57 | ATMEL32U4.15 42.69,45.99 43.47,45.21 43.47,44.57 43.59,44.45 | MCU6050.18 41.44,39.74 41.44,38.78 42.5,37.72 J4.4 | MCU6050.9 38.26,35.31 38.77,34.8 38.77,31.49 39.02,31.24 41.82,31.24 v42.58,30.48 | MCU6050.11 39.29,35.67 39.66,35.3 41.05,35.3 41.44,34.92 42.71,34.92 | 42.72,34.92 C12.2 | ATMEL32U4.23 41.11,50.29 v41.56,50.29 | ATMEL32U4.35 33.85,48.99 v33.82,49.02
  Bottom 0.203: HMC5883.9 39.26,37.6 38.9,37.97 38.39,37.97 38.26,37.85 HMC5883.11 38.26,36.07 37.75,35.56 35.87,35.56 v35.75,35.68 | R15.2 45.88,35.68 45.88,33.4 v46.52,32.76
  other vias: 23.15,38.48 48.17,29.33 53.25,32.76 55.91,40.76 53.75,43.69 47.25,42.54 32.29,35.3 31.02,40.38 31.25,46.73 30.13,50.49 35.34,51.18 44.48,29.33 44.99,44.19 43.47,35.68 29.98,45.34 23.76,43.3 24.95,46 30.51,51.61 23.15,35.41 23.15,41.1 26.55,37.89 26.55,35.76 45.63,27.68 43.72,27.43 50.96,48.38 48.47,34.8 49.44,39.88 50.96,43.18 27.36,29.82 26.12,31.82 55.91,36.45 55.91,37.46 52.87,33.65 51.09,35.18 51.11,30.83 52.74,46.23 48.67,51.43 43.59,44.57 46.52,51.69 38.64,31.49 40.47,35.86
  pour Top (no thermals): 21.24,53.72 56.8,53.72 56.8,21.71 21.24,21.71
  pour Bottom (no thermals): 21.24,53.72 56.8,53.72 56.8,21.71 21.24,21.71
MISO
  Top 0.203: J4.1 45.5,41.15 43.98,41.15 43.47,41.65 42.45,41.65 41.01,43.09 ATMEL32U4.11
MOSI
  Top 0.203: ATMEL32U4.10 40.51,42.96 42.2,41.27 43.34,41.27 43.85,40.76 45.25,40.76 45.88,40.13 45.88,38.73 J4.5
N$1
  Top 0.203: ATMEL32U4.17 42.32,46.99 42.45,46.86 42.83,46.86 44.35,45.35 16M.1
N$2
  Top 0.203: ATMEL32U4.16 42.7,46.49 44.23,44.96 44.23,43.18 44.48,42.92 45.43,42.92 16M.3
N$3
  Top 0.254: CHG.C 54.63,34.8 arc-24 51.6,28.45 51.53,28.38 IC4.1
N$4
  Top 0.254: R20.1 52.37,38.08 53.77,36.69 CHG.A
N$5
  Top 0.203: C1.2 33.05,40.51 33.69,41.15 36.23,41.15 36.86,41.78 37.88,41.78 38.13,41.53 38.64,41.53 39.02,41.91 39.02,42.42 38.51,42.92 ATMEL32U4.6
N$6
  Top 0.203: C2.2 32.93,44.96 33.05,45.08 33.05,45.72 33.31,45.97 34.07,45.97 34.55,45.49 ATMEL32U4.42
N$7
  Top 0.254: TXD.A 53.76,39.23 52.99,40 R8.1
N$8
  Top 0.203: MCU6050.10 38.79,35.42 39.42,34.8 40.52,34.8 41.03,34.29 42.58,34.29 42.83,34.54 44.48,34.54 45.1,35.16 C4.1
N$9  (via drill 0.2)
  Top 0.203: MCU6050.20 39.29,41.16 39.53,41.4 40.14,41.4 40.67,40.87 v40.67,40.51
  Bottom 0.203: v40.67,40.51 41.05,40.51 41.69,39.88 41.69,37.34 42.2,36.83 42.2,35.7 C3.1
N$10
  Bottom 0.203: D1.1 40.29,34.16 41.82,32.64 R29.2
N$11
  Top 0.203: R1.2 34.58,50.67 34.96,50.29 35.92,50.29 ATMEL32U4.33
N$12
  Top 0.203: T5.3 30.87,41.78 R18.2
N$13
  Top 0.203: R21.1 52.63,41.53 PWR.A
N$14
  Top 0.203: R12.2 47.45,50.11 49.56,48 49.56,45.84 48.65,44.93 T2.3
N$15
  Top 0.203: R10.2 30.24,46.35 28.48,46.35 28.1,45.97 28.1,44.45 28.96,43.58 T1.3
N$16
  Top 0.813: T1.1 24.82,44.55 JP11.1
N$17
  Top 0.813: JP10.1 51.21,45.49 T2.1
N$18
  Top 0.203: T3.3 26.81,37.21 R14.2
N$19
  Top 0.813: T3.1 24.29,32.64 JP13.1
N$20
  Bottom 0.203: R16.2 45.23,32.98 T4.3
N$21
  Bottom 0.813: T4.1 49.94,30.6 JP12.1
N$22
  Top 0.305: R19.1 25.7,40.99 | T5.1 26.58,40.99 25.7,40.99 | R30.1 25.7,40.99
N$23
  Bottom 0.203: HMC5883.8 39.91,37.7 40.31,37.7 40.8,37.21 40.8,36.45 41.44,35.81 41.44,35.05 41.56,34.92 42.71,34.92 42.83,34.8 42.83,33.53 42.71,33.4 41.69,33.4 40.29,34.8 38.13,34.8 37.88,35.05 34.85,35.05 C9.1
N$24  (via drill 0.2)
  Top 0.254: v47.02,52.32 46.52,52.83 30.64,52.83 v29.24,51.43
  Top 0.305: v29.24,51.43 28.86,51.05 28.86,49.65 27.34,48.13 25.31,48.13 arc24 22.51,42.03 R19.2
  Bottom 0.203: v47.02,52.32 47.91,51.43 47.91,49.4 LED5.C
  Bottom 0.305: LED4.C 29.24,49.53 v29.24,51.43
N$25
  Top 0.203: U3.6 33.63,30.28 33.94,29.97 33.94,27.19 C6.1
N$26
  Top 0.203: R22.2 42.88,28.38 IC4.5
N$27
  Top 0.203: U3.4 32.7,27.22 C6.2
N$28
  Bottom 0.203: HMC5883.12 37.76,36.32 34.32,36.32 33.55,35.54 C9.2 33.56,35.45
N$29
  Bottom 0.203: HMC5883.10 38.76,35.56 39.15,35.18 40.55,35.18 41.56,34.16 C10.1 | 42.18,34.3 C10.1 | 41.82,34.16 C10.1
N$30
  Bottom 1.016: SW2.COM 51.98,37.72 P2.1
N$31
  Top 0.203: C11.1 31.25,35.06 U4.4
N$32
  Bottom 0.203: R23.2 35.85,33.4 36.61,34.16 D1.4
N$33
  Bottom 0.203: R7.2 34.97,32.26 35.72,32.26 36.61,33.14 D1.3
N$34
  Top 0.203: U7.4 41.17,33.54 R24.2 41.56,33.75 T7.3
N$35  (via drill 0.2)
  Top 0.203: v46.77,47.5 46.34,47.07 R26.2
  Bottom 0.203: BT4.0.4 46.28,47.98 v46.77,47.5
N$36  (via drill 0.2)
  Top 0.305: R30.2 22.26,40.26 arc46 25.56,28.57 27.59,28.57 29.12,27.05 v29.37,27.05 31.15,25.27 47.4,25.27 47.91,25.78 v47.91,26.79
  Bottom 0.305: v47.91,26.79 47.91,27.79 LED6.C | LED7.C 29.01,27.41 v29.37,27.05
RESET  (via drill 0.2)
  Top 0.203: ATMEL32U4.13 42.42,44.99 42.58,44.83 42.58,43.94 v41.69,43.3 42.71,42.29 43.72,42.29 44.48,41.53 R4.1
  Bottom 0.203: J4.3 41.69,40.89 v41.69,43.3
RX  (via drill 0.2)
  Top 0.203: ATMEL32U4.20 42.86,48.49 43.98,47.37 43.98,46.61 44.48,46.1 46.52,46.1 46.77,45.84 46.77,44.19 47.02,43.94 48.29,43.94 50.07,45.72 50.07,48.13 v47.15,51.05
  Bottom 0.203: v47.15,51.05 47.08,50.98 BT4.0.2
SCK
  Top 0.203: J4.2 44.36,39.75 43.21,40.89 42.07,40.89 40.01,42.95 ATMEL32U4.9
  Bottom 0.203: 43.47,32.62 R29.1 44.36,33.51 44.36,36.32 44.61,36.57 45.37,36.57 45.88,37.08 45.88,38.73 J4.2
SCL  (via drill 0.2)
  Top 0.203: R6.1 32.8,37.97 33.18,38.35 | 33.18,38.35 33.18,39.88 34.07,40.76 36.48,40.76 37.12,41.4 37.63,41.4 37.75,41.27 | ATMEL32U4.18 42.32,47.5 42.58,47.24 v43.21,47.24 | MCU6050.23 37.75,41.27 | 37.75,41.27 | 33.18,38.35 BMP180.5
  Bottom 0.203: HMC5883.1 37.76,39.88 36.74,39.88 35.09,38.22 33.31,38.22 BMP180.5 33.31,38.1 34.96,39.75 35.34,39.75 36.61,41.02 40.29,41.02 40.93,41.65 40.93,43.81 43.21,46.1 v43.21,47.24
  other vias: 33.18,38.1
SDA  (via drill 0.2)
  Top 0.203: MCU6050.24 37.25,40.26 34.58,40.26 v34.2,39.88 33.89,39.57 v33.89,37.03 32.64,37.03 R5.1 | ATMEL32U4.19 42.59,47.99 v42.71,47.88
  Bottom 0.203: HMC5883.16 36.72,39.23 35.21,37.72 34.58,37.72 v33.89,37.03 33.43,36.57 BMP180.6 | v42.71,47.88 42.58,47.75 42.58,46.23 40.42,44.07 40.42,41.78 40.04,41.4 36.36,41.4 35.09,40.13 34.45,40.13 v34.2,39.88
TX
  Top 0.203: ATMEL32U4.21 42.86,48.99 44.68,47.18 R26.1
TXLED  (via drill 0.2)
  Top 0.203: TXD.C 52.85,40.89 50.45,40.89 49.06,42.29 v48.8,42.29 | ATMEL32U4.22 42.87,49.49 44.23,48.13 47.02,48.13 47.53,47.62 47.53,47.11 v47.02,46.61
  Bottom 0.203: v47.02,46.61 47.02,45.08 48.8,43.3 v48.8,42.29
USBD+  (via drill 0.2)
  Top 0.203: R2.2 v37.75,30.1 | ATMEL32U4.4 37.5,43.44 37.5,42.42 37.24,42.16 36.74,42.16 36.23,41.65 35.09,41.65 v34.7,42.03
  Bottom 0.203: v34.7,42.03 34.7,42.92 34.07,43.56 30.13,43.56 27.59,41.02 27.59,34.1 28.74,32.95 28.74,32 31.28,29.46 37.12,29.46 v37.75,30.1
USBD-  (via drill 0.2)
  Top 0.203: R3.2 v39.28,30.1 | ATMEL32U4.3 37.01,42.69 36.86,42.54 36.48,42.54 35.97,42.03 35.47,42.03 35.34,42.16 35.34,42.42 35.09,42.67 v34.07,42.67
  Bottom 0.203: v34.07,42.67 34.07,42.8 33.69,43.18 30.26,43.18 27.97,40.89 27.97,34.29 29.18,33.08 29.18,32.19 31.4,29.97 36.1,29.97 36.86,30.73 38.64,30.73 v39.28,30.1
VCC  (via drill 0.36)
  Top 0.406: IC4.3 49.5,30.28 50.96,31.75 50.96,33.14 v52.23,34.41
  Bottom 0.406: SW2.B 52.99,36.19 52.99,35.18 v52.23,34.41
VUSB  (via drill 0.2, 0.36)
  Top 0.203: ATMEL32U4.7 39.01,43.06 39.66,42.42 v39.66,42.03 40.19,42.03 41.82,40.41 41.82,39.11 42.2,38.73 43.47,38.73 43.85,38.35 43.85,37.08 44.36,36.57 46.52,36.57 47.15,35.94 47.15,34.03 46.77,33.65 46.24,33.65 T7.1 45.37,32.38 45.88,31.87 46.77,31.87 49.31,34.41 49.31,36.97 R20.2 | ATMEL32U4.2 36.51,43.08 36.25,42.82 36,42.82 v35.85,42.67
  Top 0.406: C17.2 v43.47,26.54 | v44.29,30.28 IC4.4 44.33,31.74 T7.1
  Bottom 0.203: v39.66,42.03 38.9,42.8 35.97,42.8 v35.85,42.67
  Bottom 0.406: J1.P1 39.84,27.48 40.42,28.06 41.94,28.06 | 41.94,28.06 v43.47,26.54 | 41.94,28.06 44.16,30.28 v44.29,30.28

### Text on the board
tPlace: Crazebird | + | + | G | V | VCC | DC3.7V | GND | + | + | USB
bPlace: CH/NO | VCC | 2015.5.18-v0.8 | GND